# Altium schematic sheet SENSOR.SchDoc
size A4; SheetNumber: 3; SheetTotal: 4
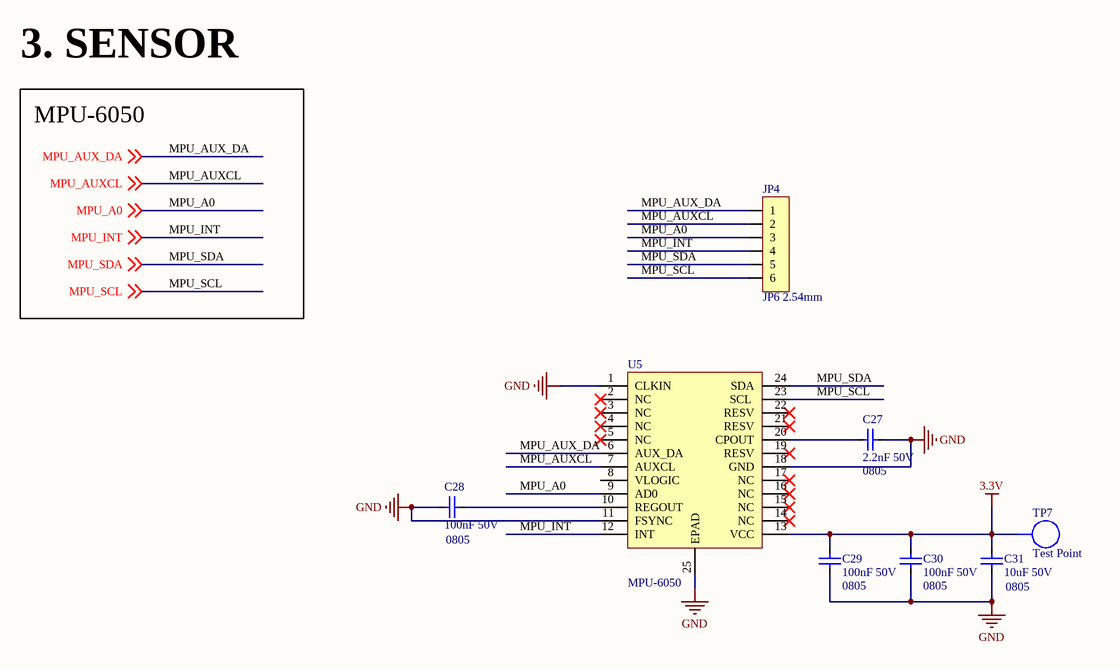
[diagram p0: SENSOR.SchDoc]

## Parts
C27  2.2nF 50V  Size: 0805  [CAP_SMD_0805_NEW]
C28  100nF 50V  Size: 0805  [CAP_SMD_0805_NEW]
C29  100nF 50V  Size: 0805  [CAP_SMD_0805_NEW]
C30  100nF 50V  Size: 0805  [CAP_SMD_0805_NEW]
C31  10uF 50V  Size: 0805  [CAP_SMD_0805_NEW]
JP4  JP6 2.54mm  [JP6_M]
TP7  Test Point  [TEST_POINT]
U5  MPU-6050  [QFN_24]

## Nets
3.3V: C29.1 C30.1 C31.2 TP7.1 U5.13(VCC)
GND: C27.1 C28.2 C29.2 C30.2 C31.1 U5.1(CLKIN) U5.11(FSYNC) U5.18(GND) U5.25(EPAD)
MPU_A0: JP4.3 U5.9(AD0) ; off-sheet MPU_A0
MPU_AUX_DA: JP4.1 U5.6(AUX_DA) ; off-sheet MPU_AUX_DA
MPU_AUXCL: JP4.2 U5.7(AUXCL) ; off-sheet MPU_AUXCL
MPU_INT: JP4.4 U5.12(INT) ; off-sheet MPU_INT
MPU_SCL: JP4.6 U5.23(SCL) ; off-sheet MPU_SCL
MPU_SDA: JP4.5 U5.24(SDA) ; off-sheet MPU_SDA
NetC27_2: C27.2 U5.20(CPOUT)
NetC28_1: C28.1 U5.10(REGOUT)

Not connected (* = marked no-connect by the designer): U5 2(NC)* 3(NC)* 4(NC)* 5(NC)* 8(VLOGIC) 14(NC)* 15(NC)* 16(NC)* 17(NC)* 19(RESV)* 21(RESV)* 22(RESV)*

## Notes on the sheet
- 3. SENSOR
- MPU-6050

## Library data of the parts
C27 = C0805_MLCC_2.2nF_50V: 2200 pF ±1% 50V Ceramic Capacitor C0G, NP0 0805 (2012 Metric); Manufacturer: YAGEO; Manufacture Part Number: CC0805FKNPO9BN222; Packaging: Cut Tape (CT); Link: https://www.digikey.cn/en/products/detail/yageo/CC0805FKNPO9BN222/5883918; Price: $0.45
C28-C30 = C0805_MLCC_100nF_50V: 0.1 µF ±10% 50V Ceramic Capacitor X7R 0805 (2012 Metric); Manufacturer: YAGEO; Manufacture Part Number: CC0805KRX7R9BB104; Packaging: Cut Tape (CT); Link: https://www.digikey.cn/en/products/detail/yageo/CC0805KRX7R9BB104/302874; Price: $0.10
C31 = C0805_MLCC_10uF_50V: 10 µF ±20% 50V Ceramic Capacitor X5R 0805 (2012 Metric); Manufacturer: Murata Electronics; Manufacture Part Number: GRM21BR61H106ME43L; Packaging: Cut Tape (CT); Link: https://www.digikey.cn/en/products/detail/murata-electronics/GRM21BR61H106ME43L/10326317; Price: $0.34
JP4 = JP6M: Connector Header Through Hole 6 position 0.100" (2.54mm); Manufacturer: Würth Elektronik; Manufacture Part Number: 61300611121; Packaging: Bulk; Link: https://www.digikey.cn/en/products/detail/w%C3%BCrth-elektronik/61300611121/4846833; Price: $0.35
TP7 = TEST_POINT
U5 = MPU-6050: Accelerometer, Gyroscope, 6 Axis Sensor I2C Output; Manufacturer: TDK InvenSense; Manufacture Part Number: MPU-6050; Packaging: Cut Tape; Link: https://www.lcsc.com/product-detail/Attitude-Sensor-Gyroscope_TDK-InvenSense-MPU-6050_C24112.html; Price: $ 7.87